# Altium project TIA.PrjPcb
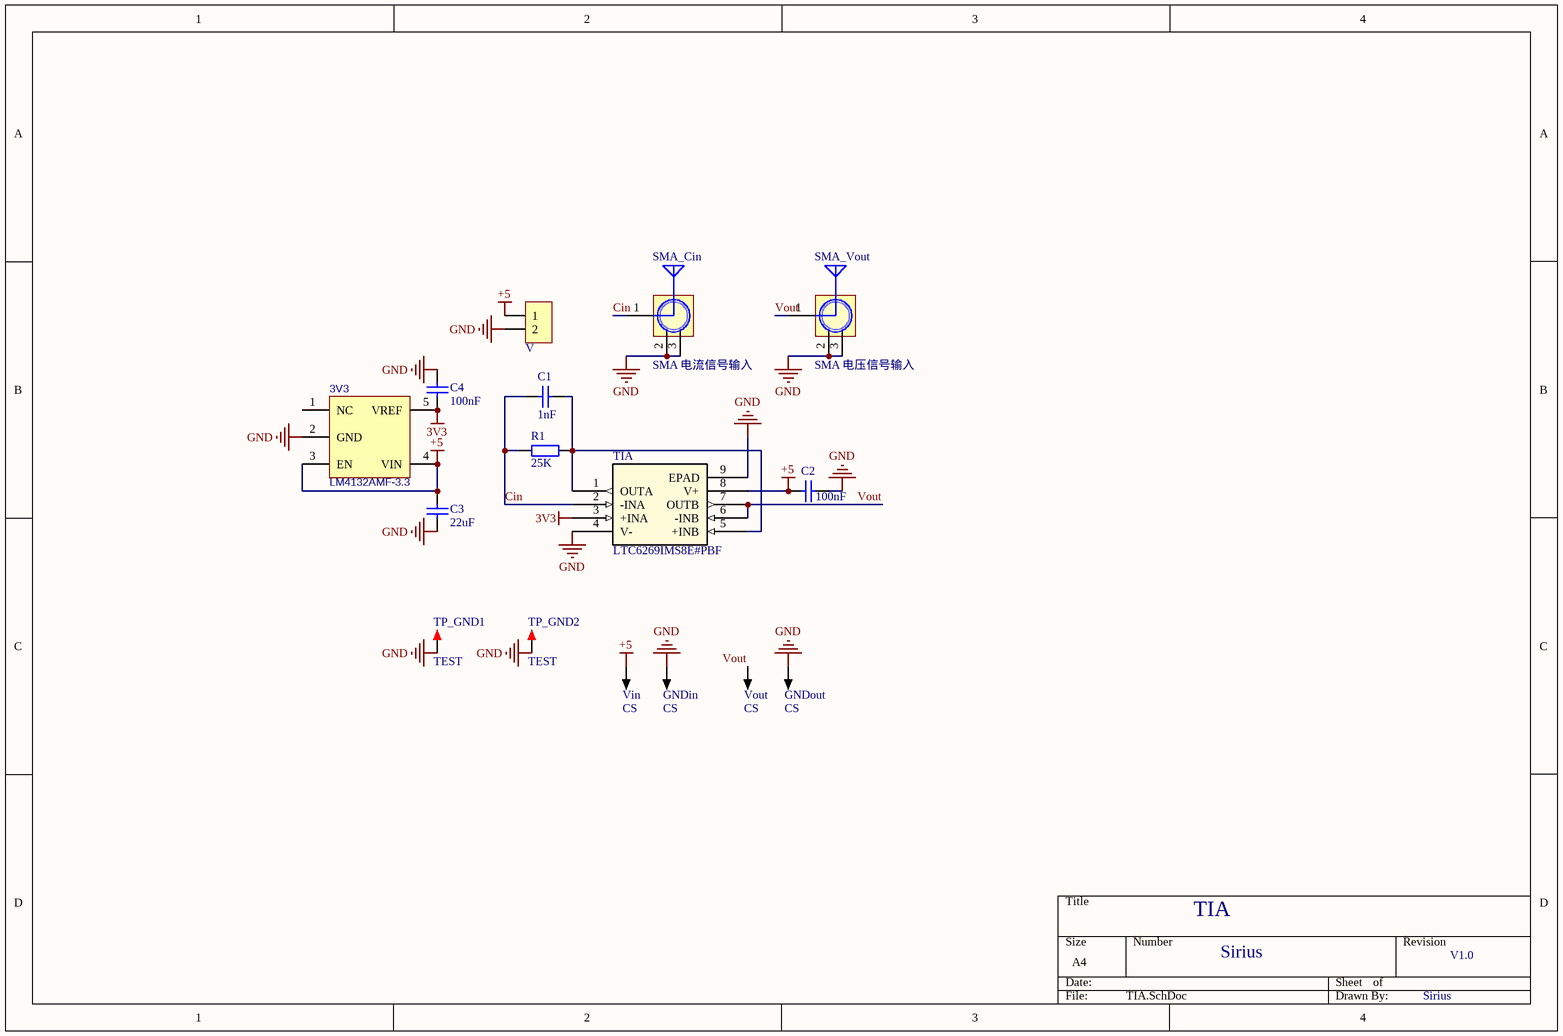
[diagram p0: TIA.SchDoc]
1 sheet, 16 parts. Net scope: global (net labels, ports and power ports of the same name join across sheets).
Board file: TIA.PcbDoc

## Sheet TIA.SchDoc
size A4; SheetNumber: 1; SheetTotal: 1

### Parts
3V3  LM4132AMF-3.3  [SOT-23-5]
C1  1nF  [C0603_L]
C2  100nF  [C0603_L]
C3  22uF  [C0603_L]
C4  100nF  [C0603_L]
GNDin  CS  [R100]
GNDout  CS  [R100]
R1  25K  [R0603_L]
SMA_Cin  SMA 电流信号输入  [SMA_FR]
SMA_Vout  SMA 电压信号输入  [SMA_FR]
TIA  LTC6269IMS8E#PBF  [MSE_8_LIT-L]
TP_GND1  TEST  [TEST 1.6]
TP_GND2  TEST  [TEST 1.6]
V  HDR-1X2  [HDR2.54-LI-2P]  (value not drawn)
Vin  CS  [R100]
Vout  CS  [R100]

### Nets
3V3: 3V3.5(VREF) C4.2 TIA.3(+INA)
+5: 3V3.3(EN) 3V3.4(VIN) C2.1 C3.1 TIA.8(V+) V.1 Vin.1
GND: 3V3.2(GND) C2.2 C3.2 C4.1 GNDin.1 GNDout.1 SMA_Cin.2(GND) SMA_Cin.3(GND) SMA_Vout.2(GND) SMA_Vout.3(GND) TIA.4(V-) TIA.9(EPAD) TP_GND1.1 TP_GND2.1 V.2
Cin: C1.2 R1.1 SMA_Cin.1(ANT) TIA.2(-INA)
Vout: SMA_Vout.1(ANT) TIA.6(-INB) TIA.7(OUTB) Vout.1
NetC1_1: C1.1 R1.2 TIA.1(OUTA) TIA.5(+INB)

Not connected (* = marked no-connect by the designer): 3V3 1(NC)

### Notes on the sheet
- TIA
- Sirius
- V1.0

### Library data of the parts
3V3 = LM4132AMF-3.3: 基准电压源 3V3; BOM名称: RT9193-30GB; 芯片厂商: RICHTEK; 封装库来自淘宝卖家 ID：黄晶宝石: 其他店铺购入均为盗版，请立即申请退款，本店现金奖励5~20元; 联系卖家 免费查找封装: 唯一出售店铺网址https://shop463601444.taobao.com
C1-C4 = C: 贴片电容; BOM名称: 无极性贴片电容; 联系卖家，免费查找封装: 唯一出售店铺网址https://shop463601444.taobao.com
GNDin GNDout Vin Vout = CS: 探针焊盘; 联系卖家，免费查找封装: 唯一出售店铺网址https://shop463601444.taobao.com; 封装库来自淘宝卖家ID：黄晶宝石: 其他店铺购入均为盗版假冒封装库，请立即申请退款; BOM名称: 探针焊盘
R1 = R: 贴片电阻; 联系卖家，免费查找封装: 唯一出售店铺网址https://shop463601444.taobao.com; BOM名称: 贴片电阻
SMA_Cin SMA_Vout = SMA: SMA-2.4G射频天线接口; 联系卖家，免费技术支持: 唯一出售店铺网址https://shop463601444.taobao.com; BOM名称: SMA-2.4G射频天线接口
TIA = LTC6269IMS8E#PBF: 低偏置电流运放; Mfr_Name: Analog Devices / Linear Technology; Copyright: Copyright (C) 2022 Ultra Librarian. All rights reserved.; Manufacturer_Part_Number: LTC6269IMS8E#PBF; RefDes: RefDes; Type: DEV
TP_GND1 TP_GND2 = TEST: 测试点; 联系卖家，免费查找封装: 唯一出售店铺网址https://shop463601444.taobao.com; 封装库来自淘宝卖家ID：黄晶宝石: 其他店铺购入均为盗版假冒封装库，请立即申请退款; BOM名称: 测试点
V = Header 2: 2P接插件; 封装库来自淘宝卖家 ID：黄晶宝石: 其他店铺购入均为盗版假冒封装库; 联系卖家，免费查找封装: 唯一出售店铺网址https://shop463601444.taobao.com; BOM名称: 2P接插件